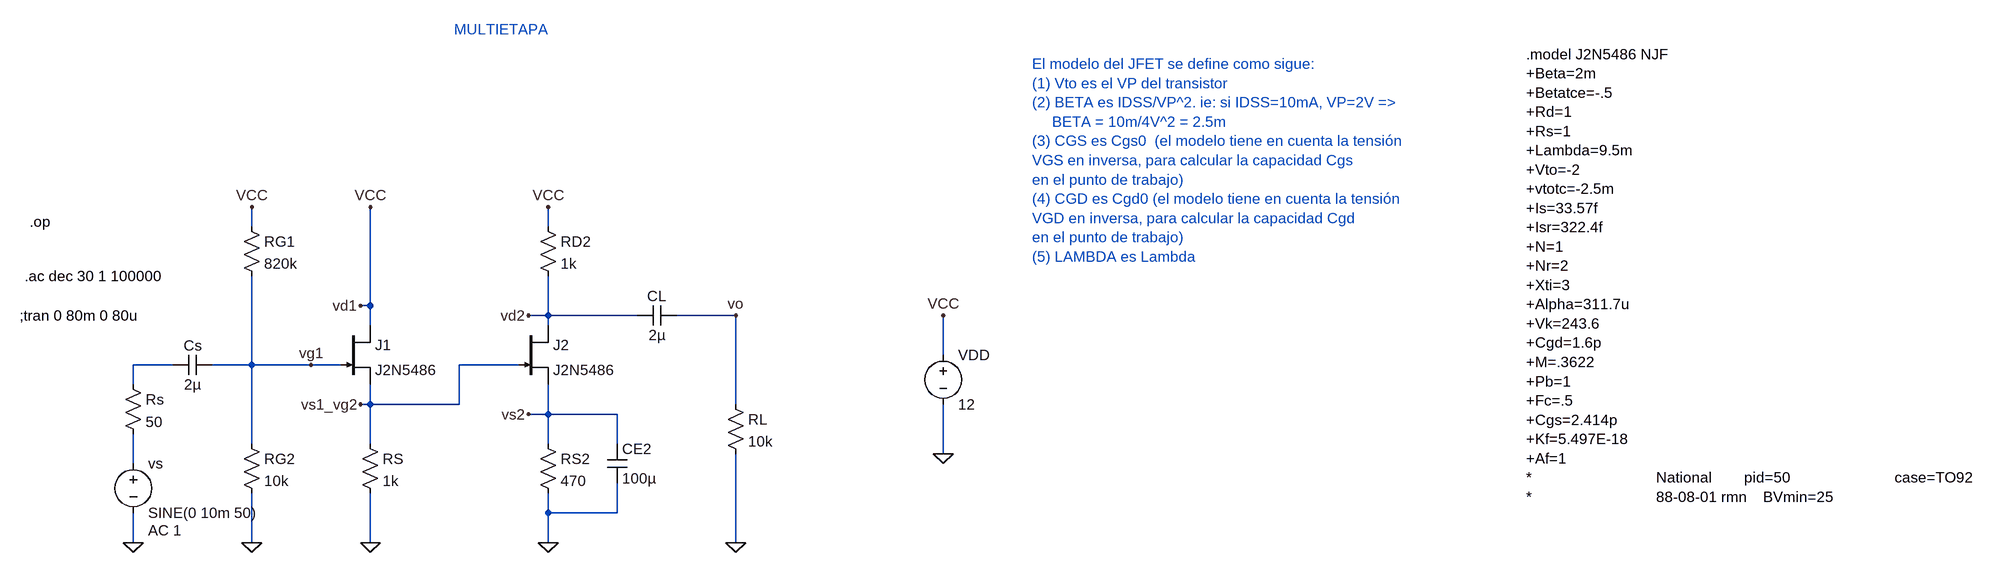
[diagram p0: schematic JFETN.asc]
JFETN.asc, the LTspice schematic file:
Version 4
SHEET 1 2452 924
WIRE -400 80 -400 48
WIRE 80 80 80 48
WIRE -208 208 -208 48
WIRE -208 208 -224 208
WIRE 80 224 80 160
WIRE 80 224 48 224
WIRE 224 224 80 224
WIRE 384 224 288 224
WIRE -208 240 -208 208
WIRE 80 240 80 224
WIRE 720 288 720 224
WIRE -528 304 -592 304
WIRE -400 304 -400 160
WIRE -400 304 -464 304
WIRE -304 304 -400 304
WIRE -256 304 -304 304
WIRE 32 304 -64 304
WIRE -592 336 -592 304
WIRE -208 368 -208 336
WIRE -208 368 -224 368
WIRE -64 368 -64 304
WIRE -64 368 -208 368
WIRE 384 368 384 224
WIRE 80 384 80 336
WIRE 80 384 48 384
WIRE 192 384 80 384
WIRE -400 432 -400 304
WIRE -208 432 -208 368
WIRE 80 432 80 384
WIRE 192 432 192 384
WIRE 720 448 720 368
WIRE -592 464 -592 416
WIRE 80 544 80 512
WIRE 192 544 192 496
WIRE 192 544 80 544
WIRE -592 592 -592 544
WIRE -400 592 -400 512
WIRE -208 592 -208 512
WIRE 80 592 80 544
WIRE 384 592 384 448
FLAG -304 304 vg1
FLAG -224 368 vs1_vg2
FLAG -224 208 vd1
FLAG -400 592 0
FLAG -208 592 0
FLAG -400 48 VCC
FLAG -208 48 VCC
FLAG 720 224 VCC
FLAG 720 448 0
FLAG -592 592 0
FLAG 80 592 0
FLAG 80 48 VCC
FLAG 384 592 0
FLAG 384 224 vo
FLAG 48 224 vd2
FLAG 48 384 vs2
SYMBOL njf -256 240 R0
SYMATTR InstName J1
SYMATTR Value J2N5486
SYMBOL res -224 416 R0
SYMATTR InstName RS
SYMATTR Value 1k
SYMBOL res -416 64 R0
SYMATTR InstName RG1
SYMATTR Value 820k
SYMBOL res -416 416 R0
SYMATTR InstName RG2
SYMATTR Value 10k
SYMBOL cap -464 288 R90
WINDOW 0 0 32 VBottom 2
WINDOW 3 32 32 VTop 2
SYMATTR InstName Cs
SYMATTR Value 2µ
SYMBOL voltage 720 272 R0
SYMATTR InstName VDD
SYMATTR Value 12
SYMBOL voltage -592 448 R0
WINDOW 123 24 124 Left 2
WINDOW 39 0 0 Left 0
SYMATTR Value2 AC 1
SYMATTR InstName vs
SYMATTR Value SINE(0 10m 50)
SYMBOL njf 32 240 R0
SYMATTR InstName J2
SYMATTR Value J2N5486
SYMBOL res 64 416 R0
SYMATTR InstName RS2
SYMATTR Value 470
SYMBOL res 64 64 R0
SYMATTR InstName RD2
SYMATTR Value 1k
SYMBOL cap 176 432 R0
SYMATTR InstName CE2
SYMATTR Value 100µ
SYMBOL cap 288 208 R90
WINDOW 0 0 32 VBottom 2
WINDOW 3 32 32 VTop 2
SYMATTR InstName CL
SYMATTR Value 2µ
SYMBOL res 368 352 R0
SYMATTR InstName RL
SYMATTR Value 10k
SYMBOL res -608 320 R0
SYMATTR InstName Rs
SYMATTR Value 50
TEXT 864 -184 Left 2 ;El modelo del JFET se define como sigue:\n(1) Vto es el VP del transistor\n(2) BETA es IDSS/VP^2. ie: si IDSS=10mA, VP=2V =>\n     BETA = 10m/4V^2 = 2.5m\n(3) CGS es Cgs0  (el modelo tiene en cuenta la tensión \nVGS en inversa, para calcular la capacidad Cgs \nen el punto de trabajo)\n(4) CGD es Cgd0 (el modelo tiene en cuenta la tensión \nVGD en inversa, para calcular la capacidad Cgd \nen el punto de trabajo)\n(5) LAMBDA es Lambda
TEXT 1664 -200 Left 2 !.model J2N5486 NJF\n+Beta=2m\n+Betatce=-.5\n+Rd=1\n+Rs=1\n+Lambda=9.5m\n+Vto=-2\n+vtotc=-2.5m\n+Is=33.57f\n+Isr=322.4f\n+N=1\n+Nr=2\n+Xti=3\n+Alpha=311.7u\n+Vk=243.6\n+Cgd=1.6p\n+M=.3622\n+Pb=1\n+Fc=.5\n+Cgs=2.414p\n+Kf=5.497E-18\n+Af=1\n*                               National        pid=50                          case=TO92\n*                               88-08-01 rmn    BVmin=25
TEXT -776 224 Left 2 !;tran 0 80m 0 80u
TEXT -768 160 Left 2 !.ac dec 30 1 100000
TEXT -760 72 Left 2 !.op
TEXT -72 -240 Left 2 ;MULTIETAPA

The netlist it stands for:
* JFETN.asc
J1 VCC vg1 vs1_vg2 J2N5486
RS vs1_vg2 0 1k
RG1 VCC vg1 820k
RG2 vg1 0 10k
Cs vg1 N001 2µ
VDD VCC 0 12
vs N002 0 SINE(0 10m 50) AC 1
J2 vd2 vs1_vg2 vs2 J2N5486
RS2 vs2 0 470
RD2 VCC vd2 1k
CE2 vs2 0 100µ
CL vo vd2 2µ
RL vo 0 10k
Rs N001 N002 50
.model NJF NJF
.model PJF PJF
.lib standard.jft
* El modelo del JFET se define como sigue:
* (1) Vto es el VP del transistor
* (2) BETA es IDSS/VP^2. ie: si IDSS=10mA, VP=2V =>
*      BETA = 10m/4V^2 = 2.5m
* (3) CGS es Cgs0  (el modelo tiene en cuenta la tensión
* VGS en inversa, para calcular la capacidad Cgs
* en el punto de trabajo)
* (4) CGD es Cgd0 (el modelo tiene en cuenta la tensión
* VGD en inversa, para calcular la capacidad Cgd
* en el punto de trabajo)
* (5) LAMBDA es Lambda
.model J2N5486 NJF
+Beta=2m
+Betatce=-.5
+Rd=1
+Rs=1
+Lambda=9.5m
+Vto=-2
+vtotc=-2.5m
+Is=33.57f
+Isr=322.4f
+N=1
+Nr=2
+Xti=3
+Alpha=311.7u
+Vk=243.6
+Cgd=1.6p
+M=.3622
+Pb=1
+Fc=.5
+Cgs=2.414p
+Kf=5.497E-18
+Af=1
*                               National        pid=50                          case=TO92
*                               88-08-01 rmn    BVmin=25
;tran 0 80m 0 80u
.ac dec 30 1 100000
.op
* MULTIETAPA
.backanno
.end